# EasyEDA schematic SCH_IV_Project_2025-03-30.json
TITLE: IV_PCB; REV: 1.0; Date: 2025-03-20; Sheet: 1/1; Drawn By: MohamedElazab; Company: STC
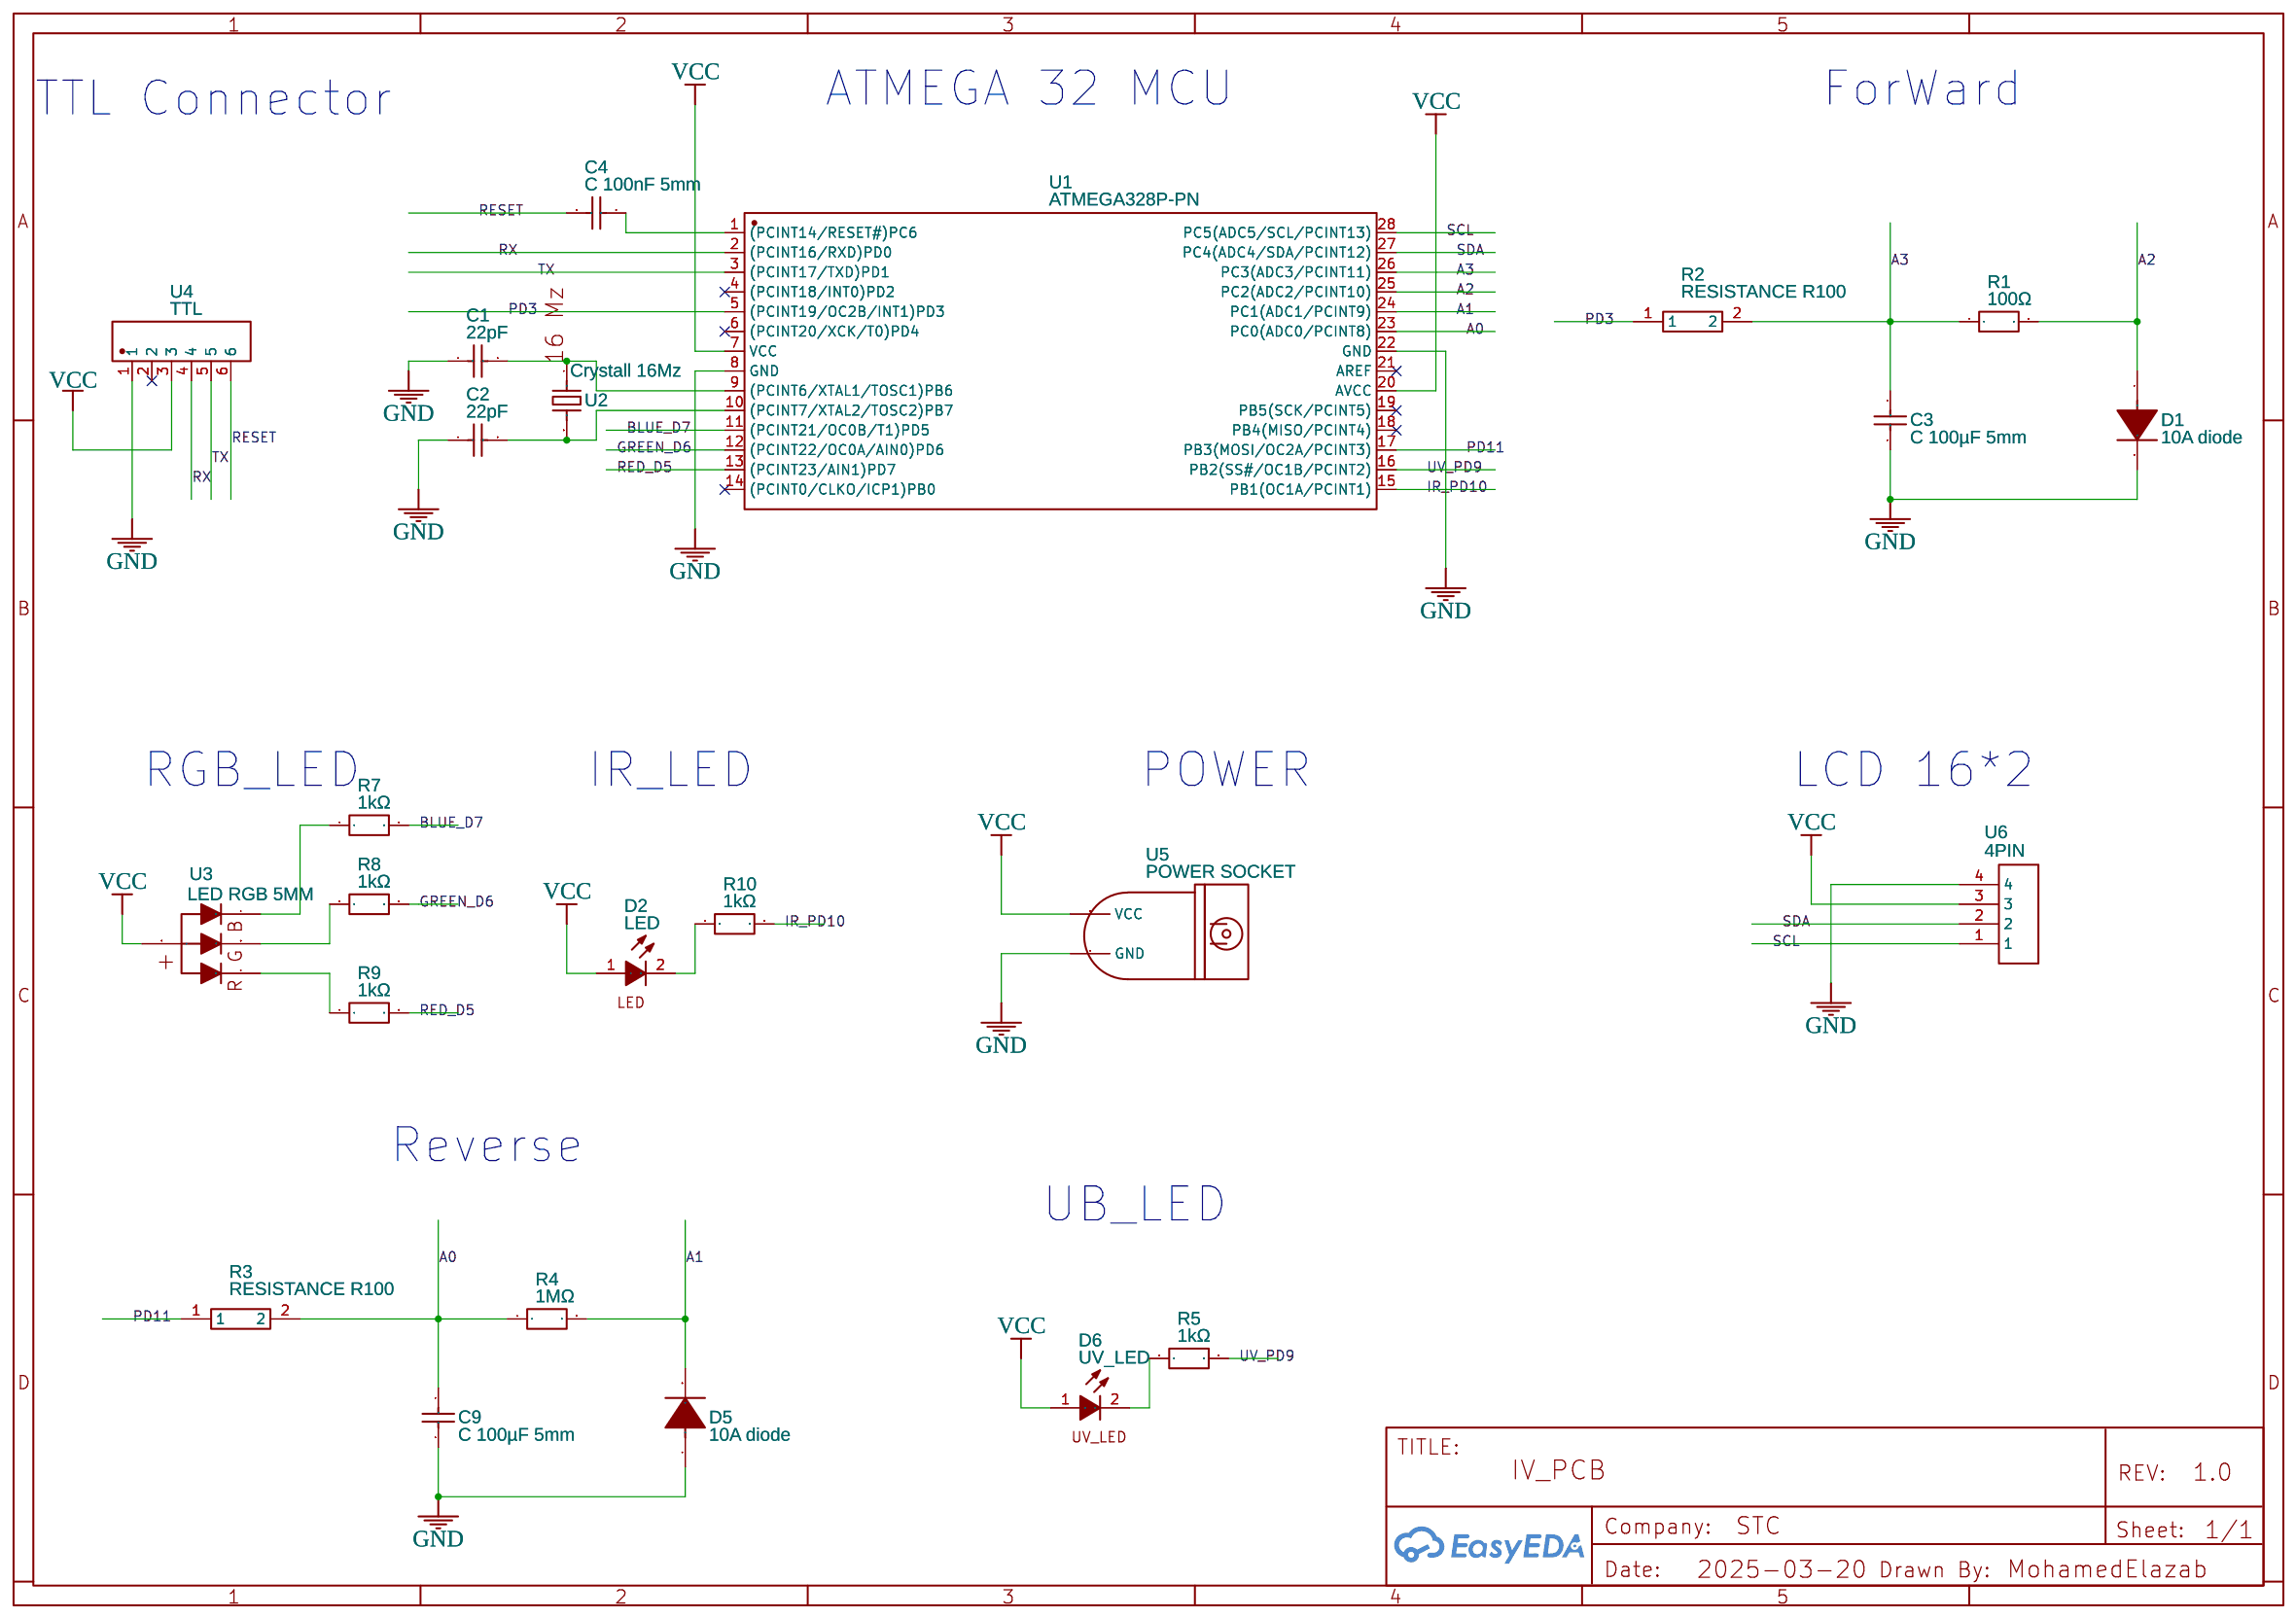
[diagram p0: schematic sheet]

## Parts
C1  22pF  [CAP-TH_L3.5-W3.0-P2.54-D0.8]
C2  22pF  [CAP-TH_L3.5-W3.0-P2.54-D0.8]
C3  C 100µF 5mm  [RAD-0.2]
C4  C 100nF 5mm  [RAD-0.2]
C9  C 100µF 5mm  [RAD-0.2]
D1  10A diode  [10 AMP DIODE]
D2  LED  [LED-TH_LED-DP2-2LED-AMCC]
D5  10A diode  [10 AMP DIODE]
D6  UV_LED  [LED-TH_LED-DP2-2LED-AMCC]
R1  100Ω  [RES-TH_BD2.4-L6.3-P10.30-D0.6]
R2  RESISTANCE R100  [RESISTANCE 100 OHM]
R3  RESISTANCE R100  [RESISTANCE 100 OHM]
R4  1MΩ  [RES-TH_BD2.4-L6.3-P10.30-D0.6]
R5  1kΩ  [RES-TH_BD2.4-L6.3-P10.30-D0.6]
R7  1kΩ  [RES-TH_BD2.4-L6.3-P10.30-D0.6]
R8  1kΩ  [RES-TH_BD2.4-L6.3-P10.30-D0.6]
R9  1kΩ  [RES-TH_BD2.4-L6.3-P10.30-D0.6]
R10  1kΩ  [RES-TH_BD2.4-L6.3-P10.30-D0.6]
U1  ATMEGA328P-PN  [PDIP-28_L35.0-W7.3-P2.54-LS7.8-BL]
U2  Crystall 16Mz  [CRYSTALL 16MZ]
U3  LED RGB 5MM  [LED RGB 5MM (ARL5RGB)]
U4  TTL  [CONN-TH_DS1021-1X6SF11-B]
U5  POWER SOCKET  [POWER CONNECTOR.]
U6  4PIN  [H4-2.54]

## Library data of the parts
C1 C2 = 22pf/50V 10%: Supplier: LCSC; Manufacturer: ReliaPro; Supplier Part: C9316; JLCPCB Part Class: Extended Part
C3 C4 C9 = C 100nF 5mm: Supplier: LCSC; Manufacturer: LCSC; Manufacturer Part: 0.1UF(104) +-20% 63v; Supplier Part: C19355; Contributor: nitipat.e
D1 D5 = 10A diode: Manufacturer: ST(先科); Manufacturer Part: 10A10; JLCPCB Part Class: Extended Part; Contributor: GA61XX
D2 D6 = LED: Supplier: Digi-Key; Manufacturer: VccLite; Manufacturer Part: 5600; Supplier Part: L20325-ND; link: https://vcclite.com/product/5602f5-5v/; Contributor: Davide Rubinigg
R1 R4 R5 R7-R10 = MFR50SFBE52-1K: Contributor: lcsc; Supplier: LCSC; Supplier Part: C1372561; Manufacturer: YAGEO(国巨); JLCPCB Part Class: Extended Part
R2 R3 = RESISTANCE R100: Contributor: Guest; Part Number: 220 ohm
U1 = ATMEGA328P-PN: Contributor: LCSC; Supplier: LCSC; Supplier Part: C1337455; Manufacturer: MICROCHIP(美国微芯); JLCPCB Part Class: Extended Part
U2 = Crystall 16Mz: Contributor: yvesborg
U3 = LED RGB 5MM (ARL5RGB) EDIT: Contributor: pedromantenimiento
U4 = DS1021-1X6SF11-B: Supplier: LCSC; Supplier Part: C7430362; Manufacturer: CONNFLY; Manufacturer Part: DS1021-1x6SF11-B; Contributor: lcsc; JLCPCB Part Class: Extended Part
U5 = POWER SOCKET: Contributor: Vladyslav1989
U6 = 4PIN: Contributor: Rekin2137; sim: true

## Nets
GND: C1.1 C2.1 C3.2 C9.2 D1.2(K) D5.1(A) U1.8(GND) U1.22(GND) U4.1 U5.2(GND) U6.4
VCC: D2.1(A) D6.1(A) U1.7(VCC) U1.20(AVCC) U3.2(4) U4.3 U5.1(VCC) U6.3
A0: C9.1 R3.2 R4.1 U1.23(PC0(ADC0/PCINT8))
A1: D5.2(K) R4.2 U1.24(PC1(ADC1/PCINT9))
A2: D1.1(A) R1.2 U1.25(PC2(ADC2/PCINT10))
A3: C3.1 R1.1 R2.2 U1.26(PC3(ADC3/PCINT11))
BLUE_D7: R7.2 U1.11((PCINT21/OC0B/T1)PD5)
GREEN_D6: R8.2 U1.12((PCINT22/OC0A/AIN0)PD6)
IR_PD10: R10.2 U1.15(PB1(OC1A/PCINT1))
PD3: R2.1 U1.5((PCINT19/OC2B/INT1)PD3)
PD11: R3.1 U1.17(PB3(MOSI/OC2A/PCINT3))
RED_D5: R9.2 U1.13((PCINT23/AIN1)PD7)
RESET: C4.1 U4.6
RX: U1.2((PCINT16/RXD)PD0) U4.4
SCL: U1.28(PC5(ADC5/SCL/PCINT13)) U6.1
SDA: U1.27(PC4(ADC4/SDA/PCINT12)) U6.2
TX: U1.3((PCINT17/TXD)PD1) U4.5
UV_PD9: R5.2 U1.16(PB2(SS#/OC1B/PCINT2))
Net-(C1-2): C1.2 U1.9((PCINT6/XTAL1/TOSC1)PB6) U2.1
Net-(C2-2): C2.2 U1.10((PCINT7/XTAL2/TOSC2)PB7) U2.2
Net-(C4-2): C4.2 U1.1((PCINT14/RESET#)PC6)
Net-(D2-2): D2.2(K) R10.1
Net-(D6-2): D6.2(K) R5.1
Net-(R7-1): R7.1 U3.4(3)
Net-(R8-1): R8.1 U3.3(2)
Net-(R9-1): R9.1 U3.1

Not connected (* = marked no-connect by the designer): U1 4((PCINT18/INT0)PD2)* 6((PCINT20/XCK/T0)PD4)* 14((PCINT0/CLKO/ICP1)PB0)* 18(PB4(MISO/PCINT4))* 19(PB5(SCK/PCINT5))* 21(AREF)*; U4 2*

## Notes on the sheet
- ATMEGA 32 MCU
- ForWard
- TTL Connector
- RGB_LED
- IR_LED
- POWER
- LCD 16*2
- Reverse
- UB_LED
